# Altium schematic sheet 10-Protections 2 of 2.SchDoc
size A
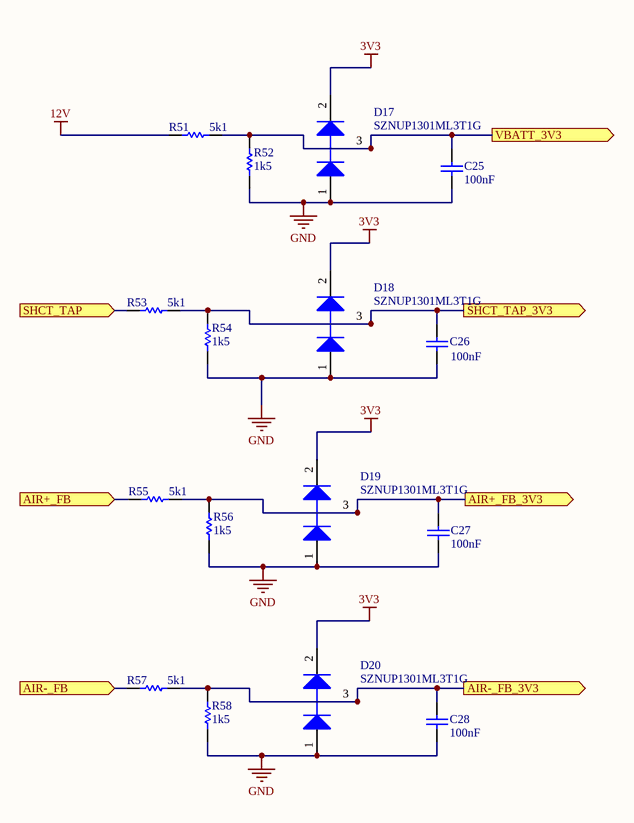
[diagram p0: 10-Protections 2 of 2.SchDoc]

## Parts
C25  value 100nF  [1608[0603]]  (hidden comment: Cap)
C26  value 100nF  [1608[0603]]  (hidden comment: Cap)
C27  value 100nF  [1608[0603]]  (hidden comment: Cap)
C28  value 100nF  [1608[0603]]  (hidden comment: Cap)
D17  SZNUP1301ML3T1G  [ONSC-SOT-23-3-318-08_V]
D18  SZNUP1301ML3T1G  [ONSC-SOT-23-3-318-08_V]
D19  SZNUP1301ML3T1G  [ONSC-SOT-23-3-318-08_V]
D20  SZNUP1301ML3T1G  [ONSC-SOT-23-3-318-08_V]
R51  value 5k1  [1608[0603]]  (hidden comment: Res1)
R52  value 1k5  [1608[0603]]  (hidden comment: Res1)
R53  value 5k1  [1608[0603]]  (hidden comment: Res1)
R54  value 1k5  [1608[0603]]  (hidden comment: Res1)
R55  value 5k1  [1608[0603]]  (hidden comment: Res1)
R56  value 1k5  [1608[0603]]  (hidden comment: Res1)
R57  value 5k1  [1608[0603]]  (hidden comment: Res1)
R58  value 1k5  [1608[0603]]  (hidden comment: Res1)

## Ports
AIR+_FB (in), AIR+_FB_3V3 (out), AIR-_FB (in), AIR-_FB_3V3 (out), SHCT_TAP (in), SHCT_TAP_3V3 (out), VBATT_3V3 (out)

## Nets
3V3: D17.2(K) D18.2(K) D19.2(K) D20.2(K)
12V: R51.1
GND: C25.1 C26.1 C27.1 C28.1 D17.1(A) D18.1(A) D19.1(A) D20.1(A) R52.1 R54.1 R56.1 R58.1
AIR+_FB: R55.1 ; port AIR+_FB
AIR+_FB_3V3: C27.2 D19.3(K/A) R55.2 R56.2 ; port AIR+_FB_3V3
AIR-_FB: R57.1 ; port AIR-_FB
AIR-_FB_3V3: C28.2 D20.3(K/A) R57.2 R58.2 ; port AIR-_FB_3V3
SHCT_TAP: R53.1 ; port SHCT_TAP
SHCT_TAP_3V3: C26.2 D18.3(K/A) R53.2 R54.2 ; port SHCT_TAP_3V3
VBATT_3V3: C25.2 D17.3(K/A) R51.2 R52.2 ; port VBATT_3V3

## Library data of the parts
C25-C28 = Cap: Capacitor; Manufacturer: Yageo; Manufacturer Part Number: CC0603KRX7R9BB104; Capacitance: 0.10µF; Tolerance: ±10%; Voltage - Rated: 50V; Temperature Coefficient: X7R; Supplier 1: Digi-Key; Supplier Part Number 1: 311-1344-1-ND; RoHS: RoHS Compliant; Category: Capacitors; Stock 1: 4016262; Pricing 1: 1=0.15, 10=0.043, 25=0.0312, 50=0.0232, 100=0.0189, 250=0.0158, 500=0.01346, 1000=0.01059 (CAD); Packaging: Cut Tape (CT); Part Status: Active; Operating Temperature: -55°C ~ 125°C; Features: -; Ratings: -; Applications: General Purpose; Failure Rate: -; Mounting Type: Surface Mount, MLCC; Package / Case: 0603 (1608 Metric); Size / Dimension: 0.063" L x 0.031" W (1.60mm x 0.80mm); Height - Seated (Max): -; Thickness (Max): 0.035" (0.90mm); Lead Spacing: -; Lead Style: -; ComponentLink1URL: http://www.yageo.com/documents/recent/UPY-GPHC_X7R_6.3V-to-50V_16.pdf; ComponentLink1Description: http://www.yageo.com/documents/recent/UPY-GPHC_X7R_6.3V-to-50V_16.pdf
D17-D20 = CMP-1063-00171-1: Low Capacitance Diode Array for ESD Protection in a Single Data Line, 3-Pin SOT-23, Pb-Free, Tape and Reel; Manufacturer: On Semiconductor; C Max (pF): 0.9; Direction: Bidirectional; V(BR) Min (V): 70; Number of Lines: 1; Mounting Technology: Surface Mount; PackageReference: SOT-23-3-318-08; DatasheetVersion: Rev. 6; PackageVersion: Rev. AP, 11/2009; RoHS: Pb-Free; ComponentLink1Description: Manufacturer URL; ComponentLink1URL: http://www.onsemi.com/; PackageDescription: 3-Pin Small Outline Transistor, Body 2.92 x 1.3 mm, Pitch 0.95 mm; PartNumber: SZNUP1301ML3T1G; Packing: Tape and Reel; ComponentLink3URL: http://www.onsemi.cn/pub_link/Collateral/318-08.PDF; ComponentLink3Description: Package Specification; VRWM Max (V): 70; ComponentLink2Description: Datasheet; ComponentLink2URL: http://www.onsemi.cn/pub_link/Collateral/NUP1301ML3T1-D.PDF
R51-R58 = Res1: Resistor; Manufacturer: Yageo; Manufacturer Part Number: RC0603JR-075K1L; Resistance (Ohms): 5.1k; Tolerance: ±5%; Power (Watts): 0.1W, 1/10W; Temperature Coefficient: ±100ppm/°C; Supplier 1: Digi-Key; RoHS: RoHS Compliant; Category: Resistors; Packaging: Cut Tape (CT); Part Status: Active; Composition: Thick Film; Features: Moisture Resistant; Operating Temperature: -55°C ~ 155°C; Package / Case: 0603 (1608 Metric); Supplier Device Package: 0603; Size / Dimension: 0.063" L x 0.031" W (1.60mm x 0.80mm); Height - Seated (Max): 0.022" (0.55mm); Number of Terminations: 2; Failure Rate: -; ComponentLink1URL: http://www.yageo.com/NewPortal/yageodocoutput?fileName=/pdf/R-Chip/PYu-RC_Group_51_RoHS_L_4.pdf; ComponentLink1Description: http://www.yageo.com/NewPortal/yageodocoutput?fileName=/pdf/R-Chip/PYu-RC_Group_51_RoHS_L_4.pdf
  R51 R53 R55 R57: Supplier Part Number 1: 311-5.1KGRCT-ND; Stock 1: 782184; Pricing 1: 1=0.16, 10=0.016, 25=0.0112, 50=0.0084, 100=0.0062, 250=0.0048, 500=0.00382, 1000=0.00281 (CAD)
  R52 R54 R56 R58: Supplier Part Number 1: 541-2789-1-ND; Stock 1: 14165; Pricing 1: 1=0.21, 10=0.192, 25=0.1332, 50=0.1038, 100=0.0741, 250=0.05776, 500=0.04586, 1000=0.03257 (CAD); ComponentLink2URL: http://www.vishay.com/docs/20065/rcse3.pdf; ComponentLink2Description: http://www.vishay.com/docs/20065/rcse3.pdf